# EAGLE design exp31dc (EAGLE 7.7.0)
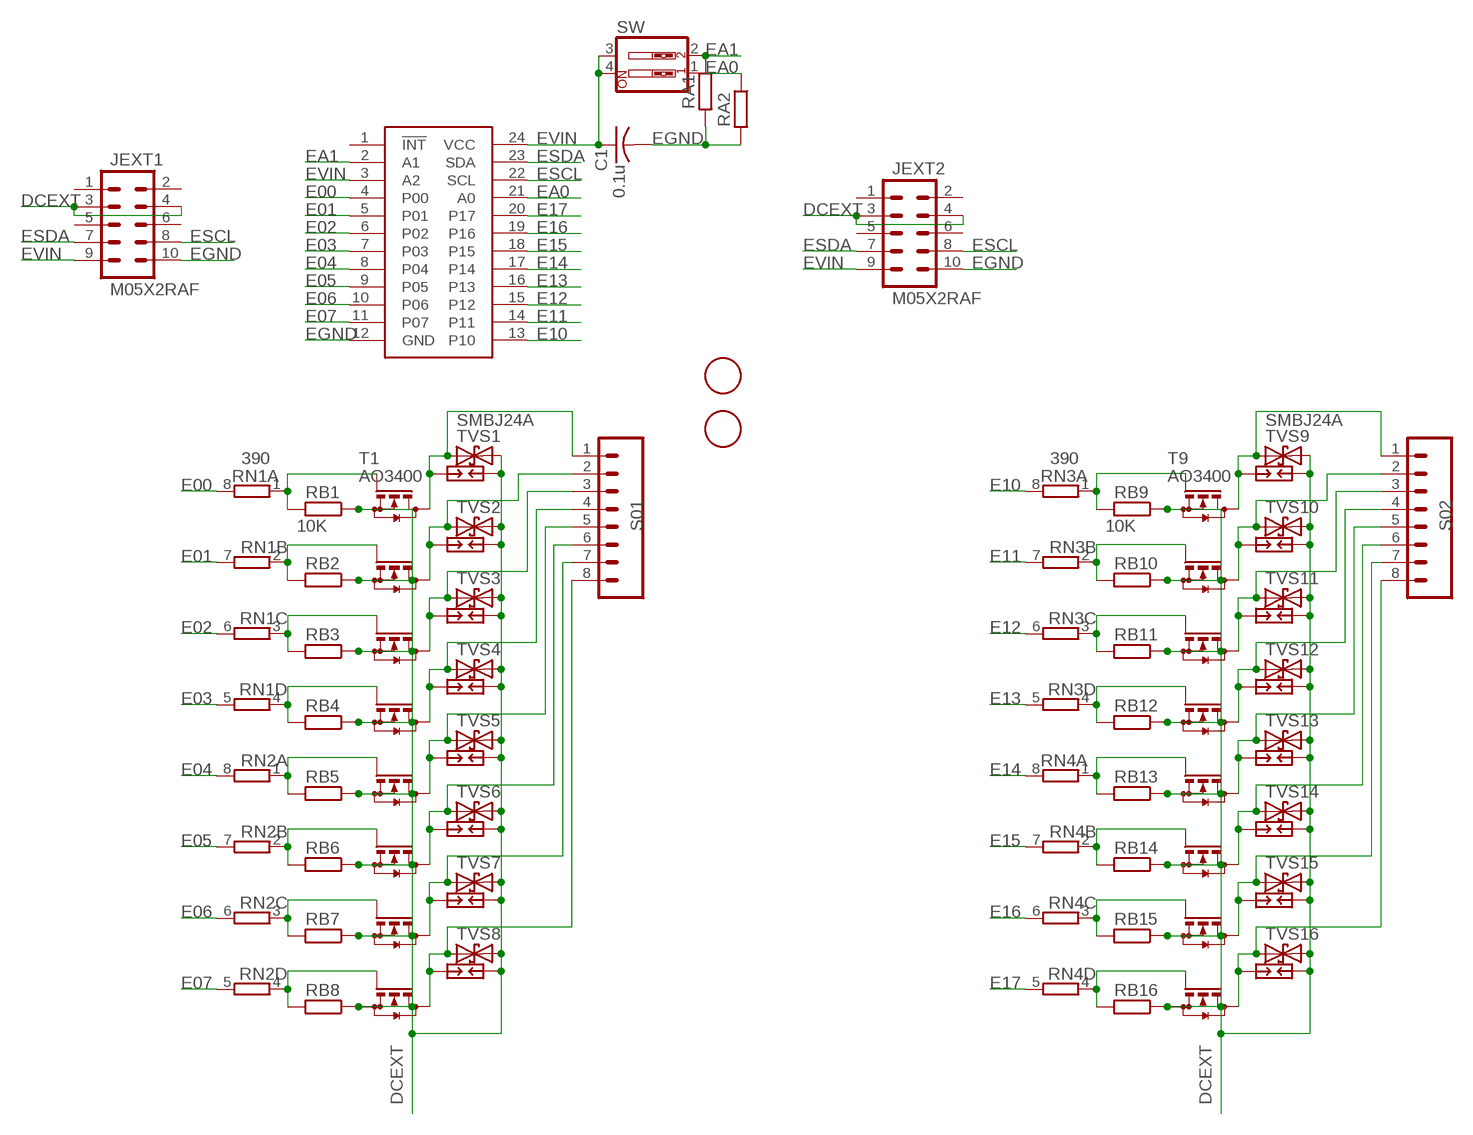
[diagram p0: schematic, sheet 1]

## Parts
C1  0.1u  C-USC0603  [C0603]
JEXT1  M05X2RAF  [2X5-RAF]
JEXT2  M05X2RAF  [2X5-RAF]
PCA9555  PCA9555  PCF8575TSSOP24  [TSSOP24]
RA1  10K  R-EU_R0603  [R0603]
RA2  10K  R-EU_R0603  [R0603]
RB1  10K  R-EU_R0603  [R0603]
RB2  10K  R-EU_R0603  [R0603]
RB3  10K  R-EU_R0603  [R0603]
RB4  10K  R-EU_R0603  [R0603]
RB5  10K  R-EU_R0603  [R0603]
RB6  10K  R-EU_R0603  [R0603]
RB7  10K  R-EU_R0603  [R0603]
RB8  10K  R-EU_R0603  [R0603]
RB9  10K  R-EU_R0603  [R0603]
RB10  10K  R-EU_R0603  [R0603]
RB11  10K  R-EU_R0603  [R0603]
RB12  10K  R-EU_R0603  [R0603]
RB13  10K  R-EU_R0603  [R0603]
RB14  10K  R-EU_R0603  [R0603]
RB15  10K  R-EU_R0603  [R0603]
RB16  10K  R-EU_R0603  [R0603]
RN1  390  4R-NEXB38V  [EXB38V]
RN2  390  4R-NEXB38V  [EXB38V]
RN3  390  4R-NEXB38V  [EXB38V]
RN4  390  4R-NEXB38V  [EXB38V]
S01  M085MM-8  [SCREWTERMINAL-5MM-8]
S02  M085MM-8  [SCREWTERMINAL-5MM-8]
SP1  PCB-SGAP  [PCB-SGAP]
SP2  PCB-SGAP  [PCB-SGAP]
SP3  PCB-SGAP  [PCB-SGAP]
SP4  PCB-SGAP  [PCB-SGAP]
SP5  PCB-SGAP  [PCB-SGAP]
SP6  PCB-SGAP  [PCB-SGAP]
SP7  PCB-SGAP  [PCB-SGAP]
SP8  PCB-SGAP  [PCB-SGAP]
SP9  PCB-SGAP  [PCB-SGAP]
SP10  PCB-SGAP  [PCB-SGAP]
SP11  PCB-SGAP  [PCB-SGAP]
SP12  PCB-SGAP  [PCB-SGAP]
SP13  PCB-SGAP  [PCB-SGAP]
SP14  PCB-SGAP  [PCB-SGAP]
SP15  PCB-SGAP  [PCB-SGAP]
SP16  PCB-SGAP  [PCB-SGAP]
SW  SW_DIP-2  [DIPSWITCH-02]
T1  AO3400  BSS123  [SOT23]
T2  AO3400  BSS123  [SOT23]
T3  AO3400  BSS123  [SOT23]
T4  AO3400  BSS123  [SOT23]
T5  AO3400  BSS123  [SOT23]
T6  AO3400  BSS123  [SOT23]
T7  AO3400  BSS123  [SOT23]
T8  AO3400  BSS123  [SOT23]
T9  AO3400  BSS123  [SOT23]
T10  AO3400  BSS123  [SOT23]
T11  AO3400  BSS123  [SOT23]
T12  AO3400  BSS123  [SOT23]
T13  AO3400  BSS123  [SOT23]
T14  AO3400  BSS123  [SOT23]
T15  AO3400  BSS123  [SOT23]
T16  AO3400  BSS123  [SOT23]
TVS1  SMBJ24A  TVSSMB  [SMB]
TVS2  SMBJ24A  TVSSMB  [SMB]
TVS3  SMBJ24A  TVSSMB  [SMB]
TVS4  SMBJ24A  TVSSMB  [SMB]
TVS5  SMBJ24A  TVSSMB  [SMB]
TVS6  SMBJ24A  TVSSMB  [SMB]
TVS7  SMBJ24A  TVSSMB  [SMB]
TVS8  SMBJ24A  TVSSMB  [SMB]
TVS9  SMBJ24A  TVSSMB  [SMB]
TVS10  SMBJ24A  TVSSMB  [SMB]
TVS11  SMBJ24A  TVSSMB  [SMB]
TVS12  SMBJ24A  TVSSMB  [SMB]
TVS13  SMBJ24A  TVSSMB  [SMB]
TVS14  SMBJ24A  TVSSMB  [SMB]
TVS15  SMBJ24A  TVSSMB  [SMB]
TVS16  SMBJ24A  TVSSMB  [SMB]
U$1  FIDUCIAL  [FIDUCIAL_1MM]
U$2  FIDUCIAL  [FIDUCIAL_1MM]

## Nets
DCEXT: JEXT1.3 JEXT1.4 JEXT2.3 JEXT2.4 RB1.1 RB2.1 RB3.1 RB4.1 RB5.1 RB6.1 RB7.1 RB8.1 RB9.1 RB10.1 RB11.1 RB12.1 RB13.1 RB14.1 RB15.1 RB16.1 SP1.1 SP2.1 SP3.1 SP4.1 SP5.1 SP6.1 SP7.1 SP8.1 SP9.1 SP10.1 SP11.1 SP12.1 SP13.1 SP14.1 SP15.1 SP16.1 T1.2(S) T2.2(S) T3.2(S) T4.2(S) T5.2(S) T6.2(S) T7.2(S) T8.2(S) T9.2(S) T10.2(S) T11.2(S) T12.2(S) T13.2(S) T14.2(S) T15.2(S) T16.2(S) TVS1.C TVS2.C TVS3.C TVS4.C TVS5.C TVS6.C TVS7.C TVS8.C TVS9.C TVS10.C TVS11.C TVS12.C TVS13.C TVS14.C TVS15.C TVS16.C
E00: PCA9555.4(P00) RN1.8
E01: PCA9555.5(P01) RN1.7
E02: PCA9555.6(P02) RN1.6
E03: PCA9555.7(P03) RN1.5
E04: PCA9555.8(P04) RN2.8
E05: PCA9555.9(P05) RN2.7
E06: PCA9555.10(P06) RN2.6
E07: PCA9555.11(P07) RN2.5
E10: PCA9555.13(P10) RN3.8
E11: PCA9555.14(P11) RN3.7
E12: PCA9555.15(P12) RN3.6
E13: PCA9555.16(P13) RN3.5
E14: PCA9555.17(P14) RN4.8
E15: PCA9555.18(P15) RN4.7
E16: PCA9555.19(P16) RN4.6
E17: PCA9555.20(P17) RN4.5
EA0: PCA9555.21(A0) RA2.1 SW.1
EA1: PCA9555.2(A1) RA1.1 SW.2
EGND [power]: C1.2 JEXT1.10 JEXT2.10 PCA9555.12(GND) RA1.2 RA2.2
ESCL: JEXT1.8 JEXT2.8 PCA9555.22(SCL)
ESDA: JEXT1.7 JEXT2.7 PCA9555.23(SDA)
EVIN [power]: C1.1 JEXT1.9 JEXT2.9 PCA9555.3(A2) PCA9555.24(VCC) SW.3 SW.4
N$1: RB9.2 RN3.1 T9.1(G)
N$2: RB4.2 RN1.4 T4.1(G)
N$3: RB3.2 RN1.3 T3.1(G)
N$8: RB1.2 RN1.1 T1.1(G)
N$9: RB2.2 RN1.2 T2.1(G)
N$17: RB10.2 RN3.2 T10.1(G)
N$18: RB5.2 RN2.1 T5.1(G)
N$19: RB6.2 RN2.2 T6.1(G)
N$21: RB7.2 RN2.3 T7.1(G)
N$22: RB8.2 RN2.4 T8.1(G)
N$24: RB11.2 RN3.3 T11.1(G)
N$26: RB12.2 RN3.4 T12.1(G)
N$27: RB13.2 RN4.1 T13.1(G)
N$28: RB14.2 RN4.2 T14.1(G)
N$29: RB15.2 RN4.3 T15.1(G)
N$30: RB16.2 RN4.4 T16.1(G)
N$33 [power]: S02.1 SP9.2 T9.3(D) TVS9.A
N$34 [power]: S02.2 SP10.2 T10.3(D) TVS10.A
N$35 [power]: S02.3 SP11.2 T11.3(D) TVS11.A
N$36 [power]: S02.4 SP12.2 T12.3(D) TVS12.A
N$37 [power]: S02.5 SP13.2 T13.3(D) TVS13.A
N$38 [power]: S02.6 SP14.2 T14.3(D) TVS14.A
N$39 [power]: S02.7 SP15.2 T15.3(D) TVS15.A
N$40 [power]: S02.8 SP16.2 T16.3(D) TVS16.A
N$50 [power]: S01.1 SP1.2 T1.3(D) TVS1.A
N$51 [power]: S01.2 SP2.2 T2.3(D) TVS2.A
N$52 [power]: S01.3 SP3.2 T3.3(D) TVS3.A
N$53 [power]: S01.4 SP4.2 T4.3(D) TVS4.A
N$54 [power]: S01.5 SP5.2 T5.3(D) TVS5.A
N$55 [power]: S01.6 SP6.2 T6.3(D) TVS6.A
N$56 [power]: S01.7 SP7.2 T7.3(D) TVS7.A
N$57 [power]: S01.8 SP8.2 T8.3(D) TVS8.A
Unconnected: JEXT1.1 JEXT1.2 JEXT1.5 JEXT1.6 JEXT2.1 JEXT2.2 JEXT2.5 JEXT2.6 PCA9555.1(!INT)

## Library data of the parts
C1 = adafruit:C-US: CAPACITOR, American symbol
JEXT1 JEXT2 = SparkFunNew:M05X2: Header 5x2 Standard 10-pin dual row 0.1" header. Commonly used with AVR-ISP. Use with Spark Fun Electronics SKU: PRT-00778
PCA9555 = SparkFunNew:PCF8575
RA1 RA2 RB1-RB16 = rcl:R-EU_: RESISTOR, European symbol
RN1-RN4 = resistor-dil:4R-N: Array Chip Resistor Source: RS Component / Phycomp; OC_FARNELL: unknown; OC_NEWARK: unknown
S01 S02 = SparkFun:M08: Header 8 Standard 8-pin 0.1" header. Use with straight break away headers (SKU : PRT-00116), right angle break away headers (PRT-00553), swiss pins (PRT-00743), machine pins (PRT-00117), and female headers (PRT-00115).
SP1-SP16 = varistor:PCB-SGAP
SW = SparkFun:SW_DIP-2: DIP SWITCH
T1-T16 = transistor-small-signal:BSS123: N-CHANNEL MOS FET
TVS1-TVS16 = SparkFunNew:TVS
U$1 U$2 = adafruitGood:FIDUCIAL: For use by pick and place machines to calibrate the vision/machine, 1mm By microbuilder.eu

## Net classes
0 default: width 0.203 mm, clearance 0.178 mm
1 power: width 0.203 mm, clearance 0.178 mm
2 relaypower: width 0.508 mm, clearance 0.508 mm

## Board
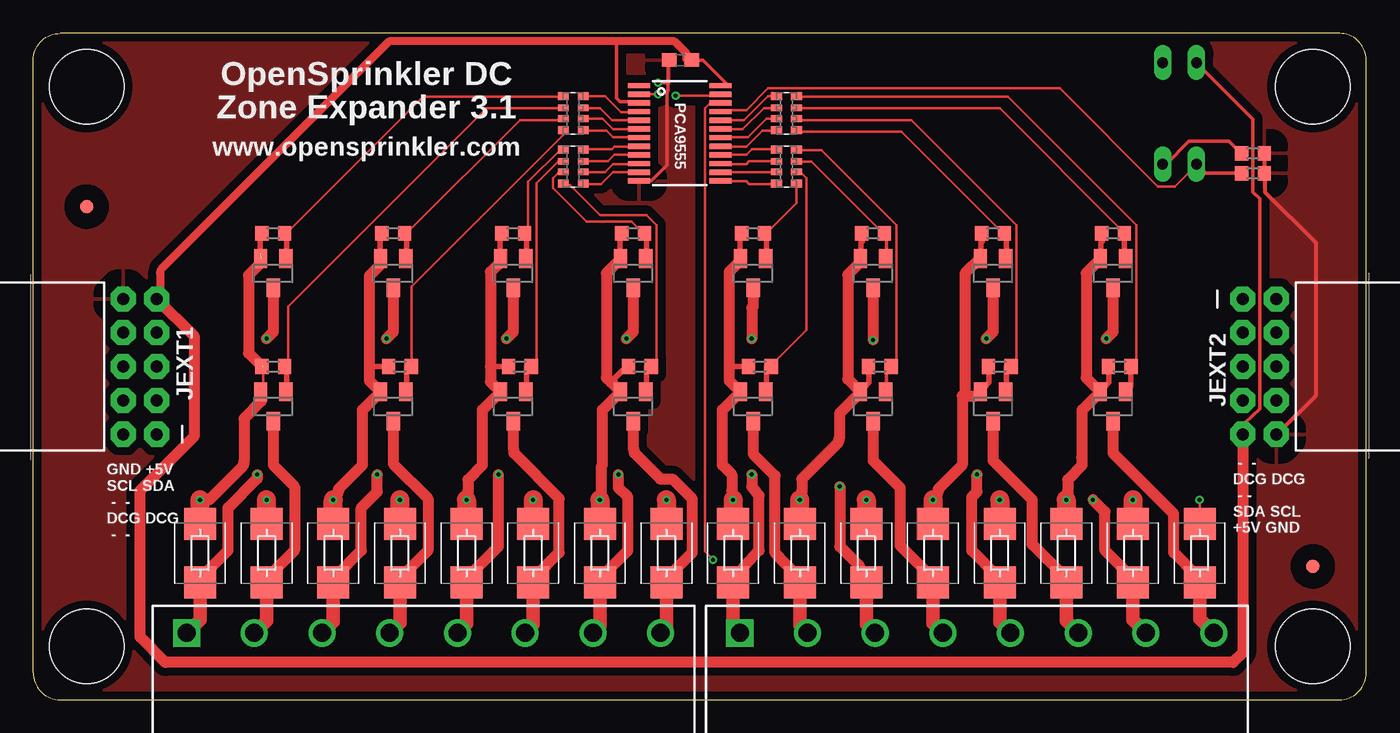
[diagram p1: board, top side]
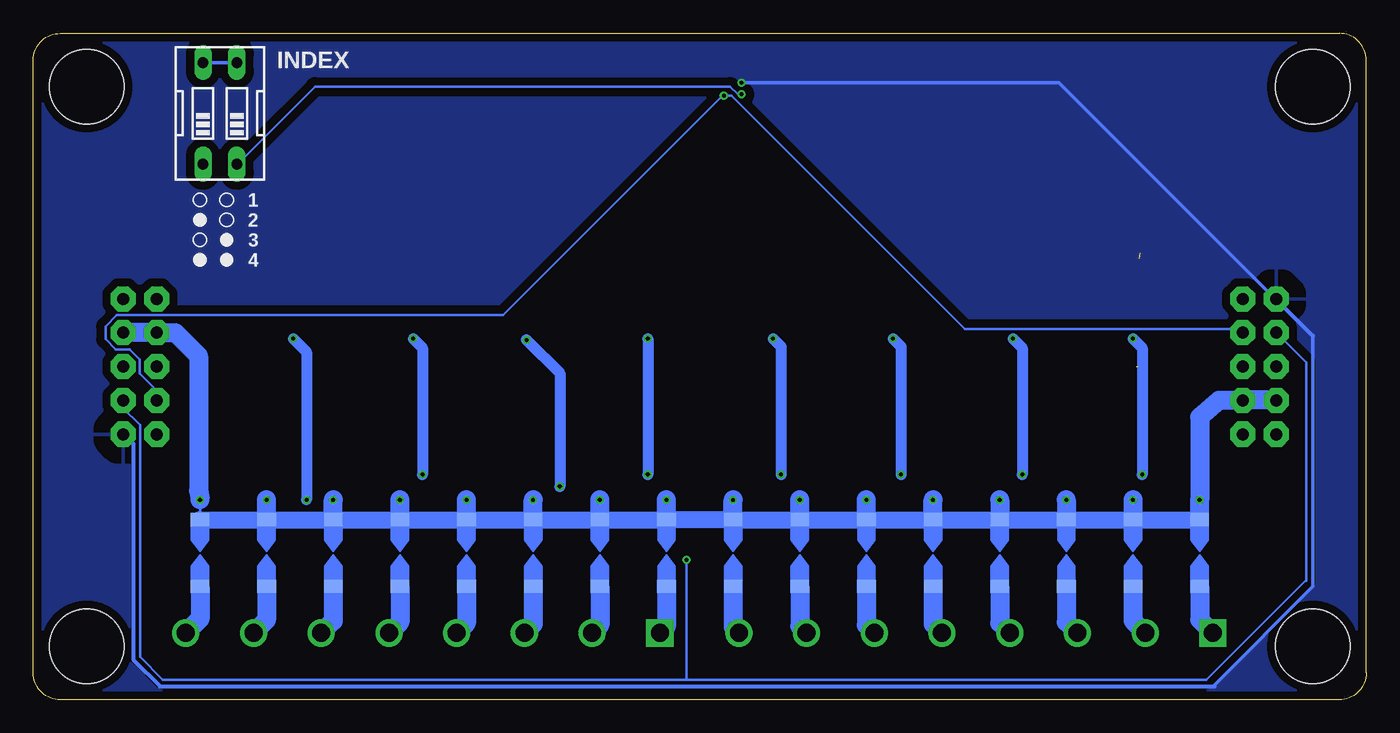
[diagram p2: board, bottom side, seen from below]

Size 100 x 50 mm. Coordinates in mm from the lower left corner, seen from the top.
Outline: 2,0 98,0 arc90 100,2 100,48 arc90 98,50 2,50 arc90 0,48 0,2 arc90 2,0
Copper layers (1*16): Top 0.035mm / dielectric 1.5mm / Bottom 0.035mm
Design rules "Fusion_eagle_rule_v1.1 *": minimum track width 6mil, minimum drill 12mil, track to track 6mil, track to pad 6mil, pad to pad 6mil, via to via 6mil, smd to smd 0mil, copper to edge 10mil, drill to drill 10mil, minimum pad ring 10mil, minimum via ring 6mil, stop-mask expansion 2mil, vias tented up to drill 100mil, thermal gap 50mil
Holes 5.6 mm at 4,4 96,4 4,46 96,46

### Footprints (pad centres in the part's own frame; a part is rotated, then mirrored left to right if it is on the bottom)
C0603 = smd 1.1 x 1: 1 -0.85,0; 2 0.85,0
2X5-RAF = drill 0.9 pad 1.88 octagon: 1 -1.27,5.08; 2 1.27,5.08; 3 -1.27,2.54; 4 1.27,2.54; 5 -1.27,0; 6 1.27,0; 7 -1.27,-2.54; 8 1.27,-2.54; 9 -1.27,-5.08; 10 1.27,-5.08
TSSOP24 = smd 0.4 x 1.65: 1 -3.575,-3.05; 2 -2.925,-3.05; 3 -2.275,-3.05; 4 -1.625,-3.05; 5 -0.975,-3.05; 6 -0.325,-3.05; 7 0.325,-3.05; 8 0.975,-3.05; 9 1.625,-3.05; 10 2.275,-3.05; 11 2.925,-3.05; 12 3.575,-3.05; 13 3.575,3.05; 14 2.925,3.05; 15 2.275,3.05; 16 1.625,3.05; 17 0.975,3.05; 18 0.325,3.05; 19 -0.325,3.05; 20 -0.975,3.05; 21 -1.625,3.05; 22 -2.275,3.05; 23 -2.925,3.05; 24 -3.575,3.05
R0603 = smd 1 x 1.1: 1 -0.85,0; 2 0.85,0
EXB38V = smd 0.6 x 0.8: 1 -1.275,-0.75; 4 1.275,-0.75; 5 1.275,0.75; 8 -1.275,0.75 | smd 0.5 x 0.8: 2 -0.4,-0.75; 3 0.4,-0.75; 6 0.4,0.75; 7 -0.4,0.75
SCREWTERMINAL-5MM-8 = drill 1.35 pad 2.032 square: 1 0,0 | drill 1.35 pad 2.032: 2 5.08,0; 3 10.16,0; 4 15.24,0; 5 20.32,0; 6 25.4,0; 7 30.48,0; 8 35.56,0
PCB-SGAP = smd 1 x 1.4 bottom: 1 -2.5,0; 2 2.5,0
DIPSWITCH-02 = drill 0.813 long: 1 -1.27,-3.81; 2 1.27,-3.81; 3 1.27,3.81; 4 -1.27,3.81
SOT23 = smd 1 x 1.4: 1 -0.95,-1.1; 2 0.95,-1.1; 3 0,1.1
SMB = smd 2.4 x 2.4: A 2.2,0; C -2.2,0
FIDUCIAL_1MM = smd 1 x 1: 1 0,0

### Placement (x,y rotation side)
C1  48.55,48 180 top
JEXT1  8,25 180 top
JEXT2  92,25 0 top
PCA9555  48.5,42.5 270 top
RA1  91.5,41 0 top
RA2  91.5,39.5 0 top
RB1  18,35 0 top
RB2  18,25 0 top
RB3  27,35 0 top
RB4  27.5,25 0 top
RB5  36,35 0 top
RB6  36.5,25 0 top
RB7  45,35 0 top
RB8  45.5,25 0 top
RB9  54,35 0 top
RB10  54.5,25 0 top
RB11  63,35 0 top
RB12  63.5,25 0 top
RB13  72,35 0 top
RB14  72.5,25 0 top
RB15  81,35 0 top
RB16  81.5,25 0 top
RN1  40.5,44 270 top
RN2  40.5,40 270 top
RN3  56.5,40 90 top
RN4  56.5,44 90 top
S01  11.5,5 0 top
S02  53,5 0 top
SP1  12.5,11 270 top
SP2  17.5,11 270 top
SP3  22.5,11 270 top
SP4  27.5,11 270 top
SP5  32.5,11 270 top
SP6  37.5,11 270 top
SP7  42.5,11 270 top
SP8  47.5,11 270 top
SP9  52.5,11 270 top
SP10  57.5,11 270 top
SP11  62.5,11 270 top
SP12  67.5,11 270 top
SP13  72.5,11 270 top
SP14  77.5,11 270 top
SP15  82.5,11 270 top
SP16  87.5,11 270 top
SW  86,44 0 bottom
T1  18,32 180 top
T2  18,22 180 top
T3  27,32 180 top
T4  27,22 180 top
T5  36,32 180 top
T6  36,22 180 top
T7  45,32 180 top
T8  45,22 180 top
T9  54,32 180 top
T10  54,22 180 top
T11  63,32 180 top
T12  63,22 180 top
T13  72,32 180 top
T14  72,22 180 top
T15  81,32 180 top
T16  81,22 180 top
TVS1  12.5,11 270 top
TVS2  17.5,11 270 top
TVS3  22.5,11 270 top
TVS4  27.5,11 270 top
TVS5  32.5,11 270 top
TVS6  37.5,11 270 top
TVS7  42.5,11 270 top
TVS8  47.5,11 270 top
TVS9  52.5,11 270 top
TVS10  57.5,11 270 top
TVS11  62.5,11 270 top
TVS12  67.5,11 270 top
TVS13  72.5,11 270 top
TVS14  77.5,11 270 top
TVS15  82.5,11 270 top
TVS16  87.5,11 270 top
U$1  4,37 0 top
U$2  96,10 0 top

### Tracks (layer width: path | path; a pad name or v marks a point on that pad's centre or on a via)
DCEXT  (via drill 0.3)  (2 unrouted)
  Top 0.203: v87.5,15 TVS16.C | 17.25,25 17.25,23.5 T2.2
  Top 0.406: 17,33.5 17,35 RB1.1 | T3.2 26,33.5 26,35 RB3.1 | RB4.1 25.2,25 | RB6.1 34.3,25 | T5.2 35,33.5 35,35 RB5.1 | T7.2 44,33.5 44,35 RB7.1 | 43.33,23.82 44.5,25 RB8.1 | RB10.1 52.2,25 | T9.2 53,33.5 53,35 RB9.1 | T12.2 62.3,23.4 62.7,23.8 62.7,25 RB12.1 | T11.2 62.1,33.5 62.1,34.3 62.2,34.4 62.2,35 RB11.1 | T13.2 71.1,33.5 71.1,34.3 71.2,34.4 71.2,35 RB13.1 | T14.2 71.3,23.4 71.7,23.8 71.7,25 RB14.1 | T15.2 80.1,33.5 80.1,34.3 80.2,34.4 80.2,35 RB15.1 | T16.2 80.3,23.4 80.7,23.8 80.7,25 RB16.1
  Top 0.813: v12.5,15 13.2,15 15.7,17.5 15.8,17.9 15.8,21.1 17.1,22.4 17.1,22.7 T2.2 17.1,23.1 | 69.7,22.8 69.7,17.6 67.9,15.8 67.9,15.6 v67.5,15 | v57.5,15 57.65,15.7 57.65,16.55 60.4,19.3 60.5,19.7 60.5,21.5 62.05,23.05 T12.2 61.1,24.05 61.1,31.9 62.05,32.85 T11.2 | v22.5,15 22.9,15.6 22.9,15.8 24.7,17.6 24.7,21.75 T4.2 25.2,23.95 25.2,25 25.2,31.8 26.05,32.65 T3.2 | v32.5,15 32.6,15.7 32.6,16.5 33.7,17.6 33.7,21.75 T6.2 34.3,23.85 34.3,25 34.3,32.1 35.05,32.85 T5.2 | v42.5,15 42.6,15.7 42.6,17.5 42.7,17.6 42.7,21.75 T8.2 43.33,23.82 43,24.15 43,32 44.05,33.05 T7.2 | v52.5,15 52.4,15.7 52.4,16.9 51.7,17.6 51.7,21.75 T10.2 52.2,23.95 52.2,25 52.2,32.1 53.05,32.95 T9.2 | v77.5,15 77.6,15.7 77.6,16.5 78.7,17.6 78.7,18.1 | 69.7,22.8 70.75,22.8 T14.2 | T13.2 71,33.1 69.9,32 69.9,23 69.7,22.8 | T15.2 80.05,33.05 79,32 79,24.15 T16.2 78.7,21.75 78.7,18.1 | 78.65,18.15 78.7,18.1 | T1.2 17.05,32.75 16.15,31.85 16.15,26 RB2.1
  Top 1.422: TVS2.C v17.5,15 | TVS3.C v22.5,15 | TVS4.C v27.5,15 | v32.5,15 TVS5.C | v37.5,15 TVS6.C | v42.5,15 TVS7.C | v47.5,15 TVS8.C | TVS1.C v12.5,15 | v52.5,15 TVS9.C | v67.5,15 TVS12.C | v72.5,15 TVS13.C | v77.5,15 TVS14.C | v82.5,15 TVS15.C | v62.5,15 TVS11.C | TVS10.C v57.5,15
  Bottom 0.203: v87.5,15 SP16.1
  Bottom 1.27: SP1.1 SP2.1 SP3.1 SP4.1 SP5.1 SP6.1 SP7.1 SP8.1 SP9.1 SP10.1 SP11.1 SP12.1 SP13.1 SP14.1 SP15.1 SP16.1
  Bottom 1.422: JEXT1.4 6.8,22.5 9.2,22.5 JEXT1.3 11.04,22.46 12.5,21.2 v12.5,15 SP1.1 | JEXT2.4 93.2,27.6 90.8,27.6 JEXT2.3 89.34,27.54 87.6,25.8 87.6,15.7 v87.5,15 | v17.5,15 SP2.1 | v22.5,15 SP3.1 22.5,13 | v27.5,15 SP4.1 | SP5.1 v32.5,15 | SP6.1 v37.5,15 | SP7.1 v42.5,15 | SP8.1 v47.5,15 | SP9.1 v52.5,15 | SP12.1 v67.5,15 | SP13.1 v72.5,15 | SP14.1 v77.5,15 | SP15.1 v82.5,15 | SP11.1 v62.5,15 | SP10.1 v57.5,15
E00
  Top 0.203: RN1.8 41.3,45.3 42.9,45.3 44.1,44.1 44.8,44.1 PCA9555.4
E01
  Top 0.203: RN1.7 42.5,44.4 43.4,43.5 44.8,43.5 PCA9555.5
E02
  Top 0.203: RN1.6 42.7,43.6 43.5,42.8 44.8,42.8 PCA9555.6
E03
  Top 0.203: RN1.5 41.3,42.7 43,42.7 43.5,42.2 44.8,42.2 PCA9555.7
E04
  Top 0.203: RN2.8 41.3,41.3 43.4,41.3 43.6,41.5 44.8,41.5 PCA9555.8
E05
  Top 0.203: RN2.7 43.1,40.4 43.6,40.9 44.8,40.9 PCA9555.9
E06
  Top 0.203: RN2.6 42.9,39.6 43.5,40.2 44.8,40.2 PCA9555.10
E07
  Top 0.203: RN2.5 41.3,38.7 42.6,38.7 43.5,39.6 44.8,39.6 PCA9555.11
E10
  Top 0.203: RN3.8 55.7,38.7 53.7,38.7 53.5,38.9 52.2,38.9 PCA9555.13
E11
  Top 0.203: RN3.7 52.2,39.6 PCA9555.14
E12
  Top 0.203: RN3.6 53.7,40.4 53.5,40.2 52.2,40.2 PCA9555.15
E13
  Top 0.203: RN3.5 55.7,41.3 53.9,41.3 53.5,40.9 52.2,40.9 PCA9555.16
E14
  Top 0.203: RN4.8 55.7,42.7 54.7,42.7 53.5,41.5 52.2,41.5 PCA9555.17
E15
  Top 0.203: RN4.7 55,43.6 53.6,42.2 52.2,42.2 PCA9555.18
E16
  Top 0.203: RN4.6 54.8,44.4 53.2,42.8 52.2,42.8 PCA9555.19
E17
  Top 0.203: RN4.5 55.7,45.3 55.1,45.3 53.3,43.5 52.2,43.5 PCA9555.20
EA0
  Top 0.203: PCA9555.21 52.25,44.12 52.38,44.25 53.5,44.25 55.12,45.88 77,45.88 84.38,38.5 85.62,38.5 87.25,40.12 SW.1
  Top 0.254: RA2.1 87.96,39.5 SW.1
EA1  (via drill 0.3)
  Top 0.203: v46.86,45.43 45.53,45.43 PCA9555.2
  Top 0.254: SW.2 84.8,40.2 85,40.2 86.7,41.9 89.7,41.9 90.6,41 RA1.1
  Bottom 0.203: v46.86,45.43 47.15,45.43 47.72,46.01 78.87,46.01 84.68,40.2 SW.2
EGND  (via drill 0.3)
  Top 0.254: 47.62,46.29 47.62,45.72 47.53,45.62 47.53,40.1 46.39,38.96 45.53,38.96 PCA9555.12 | 47.62,46.29 47.62,47.91 C1.2 | v46.86,46.29 47.62,46.29
  Top 0.305: RA1.2 RA2.2 92.4,39.4 92.4,38.1 96.2,34.3 96.2,22.8 93.3,19.9 JEXT2.10
  Bottom 0.254: 11.38,1 11.38,1.12 4,8.5 4,8.57 4,27.24 4,27.3 | v46.86,46.29 23.05,46.29 6.86,30.1 JEXT1.10
  Bottom 0.305: JEXT2.10 93.2,19.9 92.5,19.2 92.5,3 90.5,1 11.38,1 | 4,27.3 6.7,30 JEXT1.10
  pour Top (isolate 0.61): 0,50 100,50 100,0 0,0
  pour Bottom (isolate 0.61): 0,50 100,50 100,0 0,0
ESCL  (via drill 0.3)
  Top 0.203: 52.12,44.75 PCA9555.22 51.53,44.77 50.77,44.77 50.39,44.39 50.39,11.14 50.96,10.57 v51,10.5
  Bottom 0.203: JEXT2.8 93.27,21.87 92,20.6 92,3.2 90.3,1.5 51,1.5 | 51,1.5 12,1.5 4.5,9 | 4.5,8.9 4.5,9 | 4.5,9 4.5,25.31 JEXT1.8 | 51,1.5 v51,10.5
ESDA  (via drill 0.3)
  Top 0.203: v48.2,45.34 51.53,45.34 PCA9555.23
  Bottom 0.203: JEXT1.7 9.34,27.62 9.53,27.81 30.1,27.81 47.62,45.34 v48.2,45.34 48.29,45.34 64.77,28.86 93.73,28.86 94.58,28 94.58,27.05 93.82,26.29 92.77,26.29 92.01,25.53 92.01,24.48 90.77,23.24 90.77,22.48 JEXT2.7
EVIN
  Top 0.254: C1.1 50.25,48 52.12,46.12 PCA9555.24 | 43.75,49.4 43.75,45.12 44,44.88 44.75,44.88 PCA9555.3 | JEXT2.9 90.88,20.25 90.88,20.75 92,21.8 92,37.6 91.5,38.1 91.5,43.58 SW.4
  Top 0.61: C1.1 49.1,48 49,48.1 49,48.5 48.1,49.4 43.75,49.4 26.7,49.4 9.6,32.3 9.5,32 9.5,30.4 JEXT1.9
  Top 0.813: JEXT2.9 90.73,3.53 90,2.8 9.9,2.8 8,4.7 8,15.7 12.1,19.8 12.1,27.25 JEXT1.9
  Bottom 0.254: SW.3 SW.4
N$1
  Top 0.203: RN3.1 57.25,37.25 55.12,35.12 RB9.2
  Top 0.254: 55,33.5 T9.1 | 55,35 RB9.2
  Top 0.406: 55,35 55,33.5
N$2
  Top 0.203: RN1.4 39.75,42.38 28.38,31 28.38,25.12 RB4.2
  Top 0.254: 28,23.5 T4.1 | 28,25 RB4.2
  Top 0.406: 28,25 28,23.5
N$3
  Top 0.203: RN1.3 39.75,43.5 36.5,43.5 28.12,35.12 RB3.2
  Top 0.254: 28,33.5 T3.1 | 28,35 RB3.2
  Top 0.406: 28,35 28,33.5
N$8
  Top 0.203: RN1.1 39.75,45.25 29.25,45.25 19.12,35.12 RB1.2
  Top 0.254: 19,33.5 T1.1 | 19,35 RB1.2
  Top 0.406: 19,35 19,33.5
N$9
  Top 0.203: RN1.2 39.75,44.38 34,44.38 19.12,29.5 19.12,25.12 RB2.2
  Top 0.254: 19,23.5 T2.1 | 19,25 RB2.2
  Top 0.406: 19,25 19,23.5
N$17
  Top 0.203: RN3.2 57.25,39.5 57.62,39.5 58,39.12 58,27.75 55.38,25.12 RB10.2
  Top 0.254: 55,23.5 T10.1 | 55,25 RB10.2
  Top 0.406: 55,25 55,23.5
N$18
  Top 0.203: RN2.1 39.75,41.25 39.5,41.25 37.12,38.88 37.12,35.12 RB5.2
  Top 0.254: 37,33.5 T5.1 | 37,35 RB5.2
  Top 0.406: 37,35 37,33.5
N$19
  Top 0.203: RN2.2 39.75,40.38 39.38,40.38 37.75,38.75 37.75,25.5 37.38,25.12 RB6.2
  Top 0.254: 37,23.5 T6.1 | 37,25 RB6.2
  Top 0.406: 37,25 37,23.5
N$21
  Top 0.203: RN2.3 39.75,39.5 39.38,39.5 39,39.12 39,38.38 41.5,35.88 44.88,35.88 45.75,35 RB7.2
  Top 0.254: 46,33.5 T7.1 | 46,35 RB7.2
  Top 0.406: 46,35 46,33.5
N$22
  Top 0.203: RN2.4 39.75,38.62 40.25,38.62 42.5,36.38 46,36.38 46.75,35.62 46.75,25.5 46.38,25.12 RB8.2
  Top 0.254: 46,23.5 T8.1 | 46,25 RB8.2
  Top 0.406: 46,25 46,23.5
N$24
  Top 0.203: RN3.3 57.25,40.38 58.38,40.38 63.75,35 RB11.2
  Top 0.254: T11.1 64,33.5 64,35 RB11.2
N$26
  Top 0.203: RN3.4 57.25,41.25 59.12,41.25 64.75,35.62 64.75,25.5 64.38,25.12 RB12.2
  Top 0.254: T12.1 64,23.5 64,25 RB12.2
N$27
  Top 0.203: RN4.1 57.25,42.62 65.12,42.62 72.75,35 RB13.2
  Top 0.254: 73,33.5 T13.1 | 73,35 RB13.2
  Top 0.406: 73,35 73,33.5
N$28
  Top 0.203: RN4.2 57.25,43.5 65.88,43.5 73.75,35.62 73.75,25.5 73.38,25.12 RB14.2
  Top 0.254: 73,23.5 T14.1 | 73,25 RB14.2
  Top 0.406: 73,25 73,23.5
N$29
  Top 0.203: RN4.3 57.25,44.38 72.5,44.38 81.75,35.12 RB15.2
  Top 0.406: RB15.2 81.85,33.2 T15.1
N$30
  Top 0.203: RN4.4 57.25,45.25 73.12,45.25 82.75,35.62 82.75,25.38 82.5,25.12 RB16.2
  Top 0.406: RB16.2 82.35,23.5 T16.1
N$33  (via drill 0.3)
  Top 0.813: v53.9,16.9 53.9,16 54.45,15.3 54.45,11.2 52.7,9.3 TVS9.A | v53.9,27.1 53.9,29.4 54,29.5 T9.3
  Top 1.016: TVS9.A 52.5,5.5 S02.1
  Bottom 0.813: v53.9,27.1 v53.9,16.9
  Bottom 1.422: SP9.2 52.5,5.5 S02.1
N$34
  Top 0.813: TVS10.A 57.3,9.3 55.65,11 55.65,16.8 54,18.45 T10.3
  Top 1.016: TVS10.A 57.5,5.58 S02.2
  Bottom 1.422: SP10.2 57.5,5.58 S02.2
N$35  (via drill 0.3)
  Top 0.813: v60.5,16 60.5,11.5 62,10 62,9 TVS11.A | T11.3 v63,27
  Top 1.016: TVS11.A 62.5,5.66 S02.3
  Bottom 0.813: v60.5,16 60.5,24.5 v63,27
  Bottom 1.422: SP11.2 62.5,5.66 S02.3
N$36
  Top 0.813: TVS12.A 67.3,9.3 65.05,11.55 65.05,15.9 63,17.95 T12.3
  Top 1.016: TVS12.A 67.5,5.74 S02.4
  Bottom 1.422: SP12.2 67.5,5.74 S02.4
N$37  (via drill 0.3)
  Top 0.813: v71.5,27.1 72,27.6 T13.3 | v70.8,16.9 70.8,15.6 70.4,15.2 70.4,11.2 72.3,9.3 TVS13.A
  Top 1.016: TVS13.A 72.5,5.82 S02.5
  Bottom 0.813: v70.8,16.9 70.8,26.4 v71.5,27.1
  Bottom 1.422: SP13.2 72.5,5.82 S02.5
N$38
  Top 0.813: TVS14.A 77.3,9.3 74.95,11.65 74.95,15 72,17.95 T14.3
  Top 1.016: TVS14.A 77.5,5.9 S02.6
  Bottom 1.422: SP14.2 77.5,5.9 S02.6
N$39  (via drill 0.3)
  Top 0.813: v80.5,27.1 81,27.6 T15.3 | v79.5,15 80.4,14.1 80.4,11.2 82.3,9.3 TVS15.A
  Top 1.016: TVS15.A 82.5,5.98 S02.7
  Bottom 0.813: v79.5,15 79.5,26.1 v80.5,27.1
  Bottom 1.422: SP15.2 82.5,5.98 S02.7
N$40
  Top 0.813: TVS16.A 87.3,9.3 85.55,11.05 85.55,13.95 81,18.5 T16.3
  Top 1.016: TVS16.A 87.5,6.06 S02.8
  Bottom 1.422: SP16.2 87.5,6.06 S02.8
N$50  (via drill 0.3)
  Top 0.813: v16.8,16.9 16.8,16.6 14.6,14.4 14.6,11.2 12.7,9.3 TVS1.A | v17.5,27.1 18,27.6 T1.3
  Top 1.016: TVS1.A 12.5,6 S01.1
  Bottom 0.813: v16.8,16.9 16.8,26.4 v17.5,27.1
  Bottom 1.422: SP1.2 12.5,6 S01.1
N$51
  Top 0.813: TVS2.A 17.7,9.3 19.6,11.2 19.6,16 18,17.6 T2.3
  Top 1.016: TVS2.A 17.5,5.92 S01.2
  Bottom 1.422: SP2.2 17.5,5.92 S01.2
N$52  (via drill 0.3)
  Top 0.813: v26.5,27.1 27,27.6 T3.3 | v25.8,16.9 25.8,15.6 24.6,14.4 24.6,11.2 22.7,9.3 TVS3.A
  Top 1.016: TVS3.A 22.5,5.84 S01.3
  Bottom 0.813: v25.8,16.9 25.8,26.4 v26.5,27.1
  Bottom 1.422: SP3.2 22.5,5.84 S01.3
N$53
  Top 0.813: TVS4.A 27.7,9.3 29.6,11.2 29.6,15.1 27,17.7 T4.3
  Top 1.016: TVS4.A 27.5,5.76 S01.4
  Bottom 1.422: SP4.2 27.5,5.76 S01.4
N$54  (via drill 0.3)
  Top 0.813: v35.5,27.1 36,27.6 T5.3 | v34.9,16.9 34.9,11.5 32.7,9.3 TVS5.A
  Top 1.016: TVS5.A 32.5,5.68 S01.5
  Bottom 0.813: v34.9,16.9 34.9,26.5 v35.5,27.1
  Bottom 1.422: SP5.2 32.5,5.68 S01.5
N$55
  Top 0.813: TVS6.A 37.7,9.3 39.45,11.05 39.45,15.1 36.05,18.5 36,18.9 T6.3
  Top 1.016: TVS6.A 37.5,5.6 S01.6
  Bottom 1.422: SP6.2 37.5,5.6 S01.6
N$56  (via drill 0.3)
  Top 0.813: v44.5,27.1 45,27.6 T7.3 | v43.9,16.9 43.9,15.9 44.6,15.2 44.6,11.2 42.7,9.3 TVS7.A
  Top 1.016: TVS7.A 42.5,5.52 S01.7
  Bottom 0.813: v43.9,16.9 43.9,26.5 v44.5,27.1
  Bottom 1.422: SP7.2 42.5,5.52 S01.7
N$57
  Top 0.813: TVS8.A 47.7,9.3 49.45,11.05 49.45,15.05 47.95,16.55 47.05,16.55 45.1,18.5 45,18.9 T8.3
  Top 1.016: TVS8.A 47.5,5.44 S01.8
  Bottom 1.422: SP8.2 47.5,5.44 S01.8

### Text on the board
tNames: OpenSprinkler DC | Zone Expander 3.1 | www.opensprinkler.com | GND +5V / SCL SDA / - - / DCG DCG / - - | - - / DCG DCG / - - / SDA SCL / +5V GND
bNames: INDEX | 1 | 2 | 3 | 4